# Altium schematic sheet 12V-EXTRA-POWER.SchDoc
size B
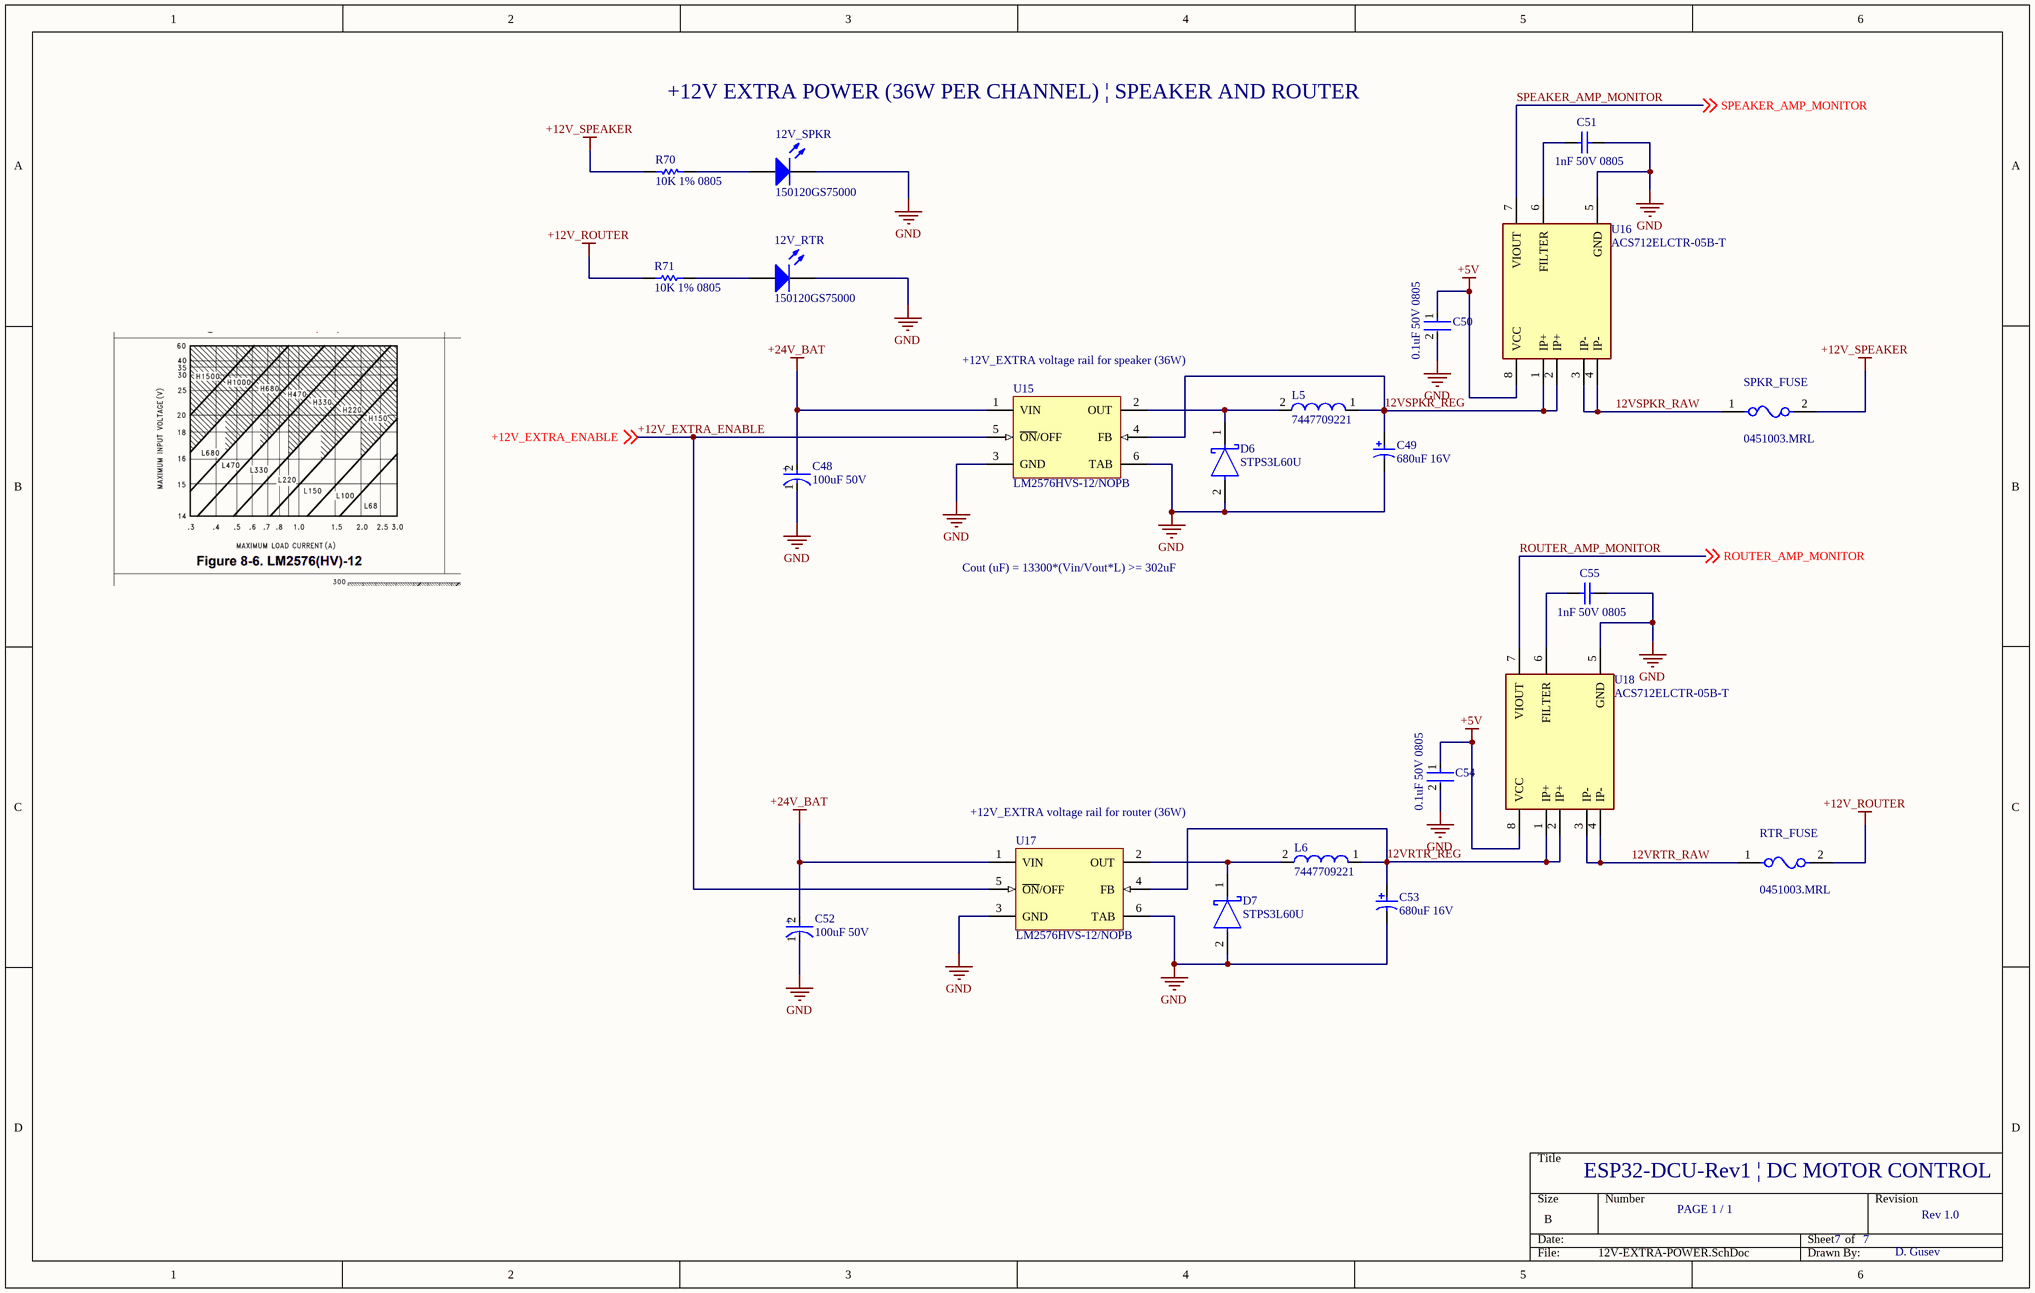
[diagram p0: 12V-EXTRA-POWER.SchDoc]

## Parts
12V_RTR  150120GS75000  [1206_A]
12V_SPKR  150120GS75000  [1206_A]
C48  100uF 50V  [FP-EEE-FK1H101P-MFG]
C49  680uF 16V  [NIC-CAPA2-10X10_V]
C50  0.1uF 50V 0805  [FP-C0805C-DN-MFG]
C51  1nF 50V 0805  [CAPC2013X94X50ML20T25]
C52  100uF 50V  [FP-EEE-FK1H101P-MFG]
C53  680uF 16V  [NIC-CAPA2-10X10_V]
C54  0.1uF 50V 0805  [FP-C0805C-DN-MFG]
C55  1nF 50V 0805  [CAPC2013X94X50ML20T25]
D6  STPS3L60U  [FP-SMB-MFG]
D7  STPS3L60U  [FP-SMB-MFG]
L5  7447709221  [WE-PD-XXL]
L6  7447709221  [WE-PD-XXL]
R70  10K 1% 0805  [RESC2013X60X35NL10T20]
R71  10K 1% 0805  [RESC2013X60X35NL10T20]
RTR_FUSE  0451003.MRL  [FP-0451-MFG]
SPKR_FUSE  0451003.MRL  [FP-0451-MFG]
U15  LM2576HVS-12/NOPB  [KTT0005B_N]
U16  ACS712ELCTR-05B-T  [FP-LC-8-IPC_A]
U17  LM2576HVS-12/NOPB  [KTT0005B_N]
U18  ACS712ELCTR-05B-T  [FP-LC-8-IPC_A]

## Nets
+5V: C50.1 C54.1 U16.8(VCC) U18.8(VCC)
+12V_ROUTER: R71.2 RTR_FUSE.2
+12V_SPEAKER: R70.2 SPKR_FUSE.2
+24V_BAT: C48.2(A) C52.2(A) U15.1(VIN) U17.1(VIN)
GND: 12V_RTR.1(K) 12V_SPKR.1(K) C48.1(C) C49.2 C50.2 C51.2 C52.1(C) C53.2 C54.2 C55.2 D6.2(A) D7.2(A) U15.3(GND) U15.6(TAB) U16.5(GND) U17.3(GND) U17.6(TAB) U18.5(GND)
12VRTR_RAW: RTR_FUSE.1 U18.3(IP-) U18.4(IP-)
12VRTR_REG: C53.1 L6.1 U17.4(FB) U18.1(IP+) U18.2(IP+)
12VSPKR_RAW: SPKR_FUSE.1 U16.3(IP-) U16.4(IP-)
12VSPKR_REG: C49.1 L5.1 U15.4(FB) U16.1(IP+) U16.2(IP+)
+12V_EXTRA_ENABLE: U15.5(~{ON}/OFF) U17.5(~{ON}/OFF) ; off-sheet +12V_EXTRA_ENABLE
ROUTER_AMP_MONITOR: U18.7(VIOUT) ; off-sheet ROUTER_AMP_MONITOR
SPEAKER_AMP_MONITOR: U16.7(VIOUT) ; off-sheet SPEAKER_AMP_MONITOR
Net12V_RTR_2: 12V_RTR.2(A) R71.1
Net12V_SPKR_2: 12V_SPKR.2(A) R70.1
NetC51_1: C51.1 U16.6(FILTER)
NetC55_1: C55.1 U18.6(FILTER)
NetD6_1: D6.1(K) L5.2 U15.2(OUT)
NetD7_1: D7.1(K) L6.2 U17.2(OUT)

## Notes on the sheet
- +12V EXTRA POWER (36W PER CHANNEL) | SPEAKER AND ROUTER
- (near U15) +12V_EXTRA voltage rail for speaker (36W)
- Cout (uF) = 13300*(Vin/Vout*L) >= 302uF
- (near U17) +12V_EXTRA voltage rail for router (36W)
- ESP32-DCU-Rev1 | DC MOTOR CONTROL
- PAGE 1 / 1
- 7
- Rev 1.0
- D. Gusev
- (in symbol CMP-2000-06208-2) +

## Library data of the parts
12V_RTR 12V_SPKR = CMP-1426-00014-1: SMD mono-color Chip LED, WL-SMCW, Green; Manufacturer: Wuerth Elektronik; PackageReference: 1206_A; PartNumber: 150120GS75000; ComponentLink1Description: Manufacturer URL; ComponentLink2URL: http://katalog.we-online.com/led/datasheet/150120GS75000.pdf; ComponentLink2Description: Datasheet; Color: Green; ComponentLink1URL: http://www.we-online.com
C48 C52 = CMP-2000-06208-2: CAP ALUM 100UF 20% 50V SMD; Manufacturer Part Number: EEE-FK1H101P; Manufacturer: Panasonic Electronic Components; Automotive Grade: Grade 2; Dissipation Factor: 10%; Life: 2000Hours; Ripple Current: 350mA; Material: Aluminum; Esr: 0.34Ω; Leakage Current: 50uA; Tolerance: 20%; Package: 0; ComponentLink2URL: https://industrial.panasonic.com/cdbs/www-data/pdf/RDE0000/ABA0000C1181.pdf; Temperature Range Low: -55°C; Voltage Rating: 50V; ComponentLink2Description: Datasheet; Category: Cap; Digikey Description: CAP ALUM 100UF 20% 50V SMD; Octopart: https://octopart.com/eeefk1h101p-panasonic-4642841; Automotive: Yes; Temperature: -55°C to +105°C; Capacitance: 100uF; Lead Free: Yes; Mouser Description: Cap Aluminum Lytic 100uF 50V 20% (8 X 10.2mm) SMD 350mA 2000h 105C Automotive T/R; Height: 10.5mm; Device Class L3: Aluminum Electrolytic Capacitors; Value: 100uF; Device Class L1: Passive Components; RoHS: TRUE; Device Class L2: Capacitors; Temperature Range High: +105°C
C49 C53 = CMP-0687-00005-1: Aluminum Electrolytic Capacitor, UD Series, Low Impedance, 680 uF, 16 V, + / - 20%, -55 to 105 degC, Chip Type, 10 x 10 mm D x L, Pb-Free, Reel; Manufacturer: Nichicon; PartNumber: UUD1C681MNL1GS; Packing: Dia382mm Reel; Tolerance Rated Capacitance: -20 to 20%; Rated Ripple Current (at 100kHz): 670 mA; Endurance Time: 5000 h; Impedance: 0.09 Ohm; ComponentLink1Description: Manufacturer URL; RoHS: TRUE; ComponentLink2Description: Datasheet; ComponentLink1URL: http://www.nichicon.co.jp/; ComponentLink3URL: http://products.nichicon.co.jp/en/pdf/XJA043/e-ud.pdf; ComponentLink3Description: Package Specification; PackageDescription: 2-Pin Surface Mount Device, Diameter 10 mm, Height 10 mm, Pitch 8 mm; Rated Capacitance: 680 uF; Length: 10 mm; Diameter: 10 mm; Mounting Technology: Surface Mount; Rated Voltage: 16 V; ComponentLink2URL: http://products.nichicon.co.jp/en/pdf/XJA043/e-ud.pdf; DatasheetVersion: 08/2012; PackageReference: CAPAE-D10H10
C50 C54 = CMP-2007-00279-2: CAP CER 0.1UF 50V X7R 0805; Manufacturer Part Number: C0805C104K5RACTU; Manufacturer: KEMET; Value: 0.10 μF; Tolerance: 0.1; Temperature Coefficient: 30ppm/°C; Material: Ceramic; Device Class L2: Capacitors; Temperature Range Low: -55°C; Voltage Rating: 50 V; Digikey Description: CAP CER 0.1UF 50V X7R 0805; Category: Cap; ComponentLink2Description: Datasheet; Octopart: https://octopart.com/c0805c104k5ractu-kemet-143926; RoHS: TRUE; ComponentLink2URL: https://content.kemet.com/datasheets/KEM_C1003_C0G_SMD.pdf; Temperature Characteristic: X7R; Temperature: -55°C to +125°C; Height: 0.88mm; Temperature Range High: +125°C; Device Class L1: Passive Components; Automotive: No; Lead Free: Yes; Ipc Land Pattern Name: CAPC200125X78; Device Class L3: Ceramic Capacitors; Mouser Description: Cap Ceramic 0.1uF 50V X7R 10% SMD 2.0 x 1.2 mm 125 C Paper T/R; Capacitance: 0.10 μF; Package: C0805C-DN
C51 C55 = CMP-1036-02979-2: Part Number: 08055C102KAT2A.; Manufacturer: AVX Interconnect / Elco
D6 D7 = CMP-12187-000023-1: DIODE SCHOTTKY 60V 3A SMB; Manufacturer: STMicroelectronics; Standoff Height: 0.05mm; Peak Reverse Current: 150uA; Max Junction Temp: +150°C; Max Surge Forward Current: 100A; Octopart: https://octopart.com/stps3l60u-stmicroelectronics-334329; Category: Diode; Height: 2.65mm; RoHS: TRUE; Mouser Description: Schottky diode Configuration: Single Housing type: DO-214AA=SMB Peak conducting-state current: 100 A; Forward Current: 3A; Manufacturer Part Number: STPS3L60U; Temperature: to +150°C; ComponentLink2URL: https://www.st.com/resource/en/datasheet/stps3l60.pdf; Max Repetitive Reverse Voltage: 60V; Device Class L1: Discrete Semiconductors; Automotive: No; Device Class L3: Schottky Diodes; Digikey Description: DIODE SCHOTTKY 60V 3A SMB; Lead Free: Yes; Temperature Range High: +150°C; Package: SMB; ComponentLink2Description: Datasheet; Device Class L2: Diodes
L5 L6 = CMP-0227-00173-1: SMD-Shielded Power Inductor WE-PD, L = 220 µH; Inductance: 220 ÂµH; PackageReference: WE-PD-XXL; ComponentLink1URL: http://www.we-online.com; PackageDescription: SMD Inductor, 2-Leads, Body 12.0 x 12.0 mm; ComponentLink2URL: http://www.we-online.de/katalog/media/pdf/7447709221.pdf; DatasheetVersion: ver 1, Oct-2004; ComponentLink2Description: Datasheet; PackageVersion: 2004; ComponentLink1Description: Manufacturer Link
R70 R71 = CMP-1659-00013-4: Chip Resistor, 10 KOhm, +/- 1%, 0.125 W, -55 to 155 degC, 0805 (2012 Metric), RoHS, Tape and Reel; Manufacturer: Yageo; Voltage Rating: 150 V; Mount: Surface Mount; ComponentLink1Description: Manufacturer URL; ComponentLink2URL: http://www.yageo.com/documents/recent/PYu-RC_Group_51_RoHS_L_04.pdf; Pins: 2; Length: 2 mm; Min Operating Temperature: -55 degC; Height: 0.5 mm; Mounting Technology: Surface Mount; RoHSCompliant: true; REACH SVHC: No SVHC; ComponentLink1URL: http://www.yageo.com/; Max Operating Temperature: 155 degC; PackageReference: 0805; DatasheetVersion: Rev. 4, 02/2016; Package Quantity: 5000; Packaging: Tape and Reel; ComponentLink2Description: Datasheet; PackageDescription: 2-Pin Surface Mounted Device, Body 2 x 1.25 mm
RTR_FUSE SPKR_FUSE = CMP-08605-000063-1: FUSE BRD MNT 3A 125VAC/VDC 2SMD; Manufacturer: Littelfuse Inc; Fuse Interrupt Ac Current: 50A; Voltage Rating: 125V; Fuse I2T: 1.65A2Sec; Resistance: 0.0227Ω; Fuse Blow Speed: Fast; Value: 0.0227Ω; RoHS: TRUE; Automotive: No; Max Fuse Dc Voltage: 125V; Mouser Description: Surface Mount Fuses 125V 3A; Package: 0451; Device Class L2: Fuses; Fuse Current: 3A; Manufacturer Part Number: 0451003.MRL; ComponentLink2Description: Datasheet; Lead Free: Yes; Temperature Range Low: -55°C; Max Fuse Ac Voltage: 125V; Temperature: -55°C to +125°C; Device Class L1: Circuit Protection; Octopart: https://octopart.com/0451003.mrl-littelfuse-566380; Category: Fuse; Height: 2.94mm; Temperature Range High: +125°C; ComponentLink2URL: https://www.littelfuse.com/~/media/electronics/datasheets/fuses/littelfuse_fuse_451_453_datasheet.pdf.pdf; Digikey Description: FUSE BRD MNT 3A 125VAC/VDC 2SMD; Device Class L3: unset; Fuse Interrupt Dc Current: 50A
U15 U17 = CMP-0069-00133-3: SIMPLE SWITCHER® 3A Step-Down Voltage Regulator, 5-pin TO-263, Pb-Free; Manufacturer: Texas Instruments; PowerWise: N; PackageTopMarking: NSUZXYTTE#*LM2576*HVS-12 P+; RoHS: Y; ComponentLink1Description: Datasheet URL; ComponentLink1URL: http://www.ti.com/general/docs/lit/getliterature.tsp?genericPartNumber=LM2576HV&fileType=pdf; PackageReference: KTT0005B; PackageDescription: TO-263, Molded, .400 x .390 x .180in, 5 Lead, .067in Pitch, Surface Mount; PinCount: 5; CompType: Switcher; Code_JEDEC: MO-169-AB
U16 U18 = CMP-2000-04989-2: SENSOR CURRENT HALL 5A AC/DC; Output Current: 10mA; Response Time: 5us; Number of Channels: 1; Sensitivity: 185mV/A; Polarity: Bidirectional; Linearity: 1.5%; Max Supply Current: 13mA; Frequency: 80kHz; Max Supply Voltage: 5.5V; Min Supply Voltage: 4.5V; Voltage: 5V; Mount: Surface Mount; Max Operating Temperature: 85°C; Min Operating Temperature: -40°C; Termination: SMD/SMT; Number of Pins: 8; Accuracy: 1.5%; Current Sensing: 5A; Length: 4.9mm; Package Quantity: 1; REACH SVHC: No SVHC; Packaging: Cut Tape; Series: -; Height: 1.5mm; Width: 3.9mm; Operating Supply Voltage: 5V; Bandwidth: 80kHz; Case/Package: SOIC; Lead Free: Lead Free; Quiescent Current: 10mA; RoHS Compliant: Yes